# EAGLE design Schematic (EAGLE 9.4.0)
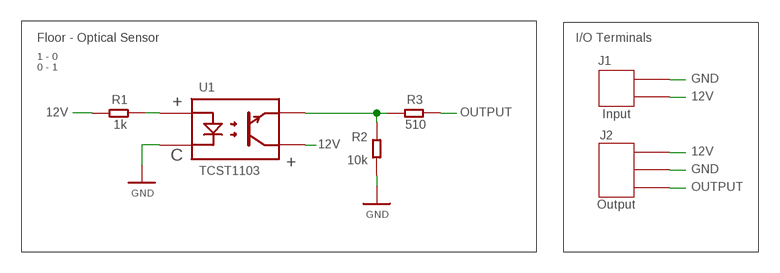
[diagram p0: schematic, sheet 1]

## Parts
J1  WF-2R  [WF-2R]
J2  WF-3R  [WF-3R]
R1  1k  SMD-RES-0603  [SMD-RES-0603]
R2  10k  SMD-RES-0603  [SMD-RES-0603]
R3  510  SMD-RES-0603  [SMD-RES-0603]
U1  TCST1103  [TCST1103]

## Nets
12V: J1.P$1 J2.P$3 R1.2 U1.OUTPUT_VCC
GND: J1.P$2 J2.P$2 R2.2 U1.INPUT_C(C)
N$1: R1.1 U1.INPUT_VCC
N$2: R2.1 R3.2 U1.OUTPUT
OUTPUT: J2.P$1 R3.1

## Notes on the sheet
- Floor - Optical Sensor | I/O Terminals
- 1 - 0
- 0 - 1
- Input
- Output

## Library data of the parts
J1 = Elevator:WF-2R: WF-2R - Socket x2 pins Step - 2.54
J2 = Elevator:WF-3R: WF-3R - Socket x3 pins Step - 2.54
R1-R3 = Network_Board Lib:SMD-RES-0603: SMD Resistor 0603 Size Reccomended for use. Vishay design source
U1 = Elevator:TCST1103: TCST1103 - Transmissive Optical Sensor with Phototransistor Output Vishay

## Board
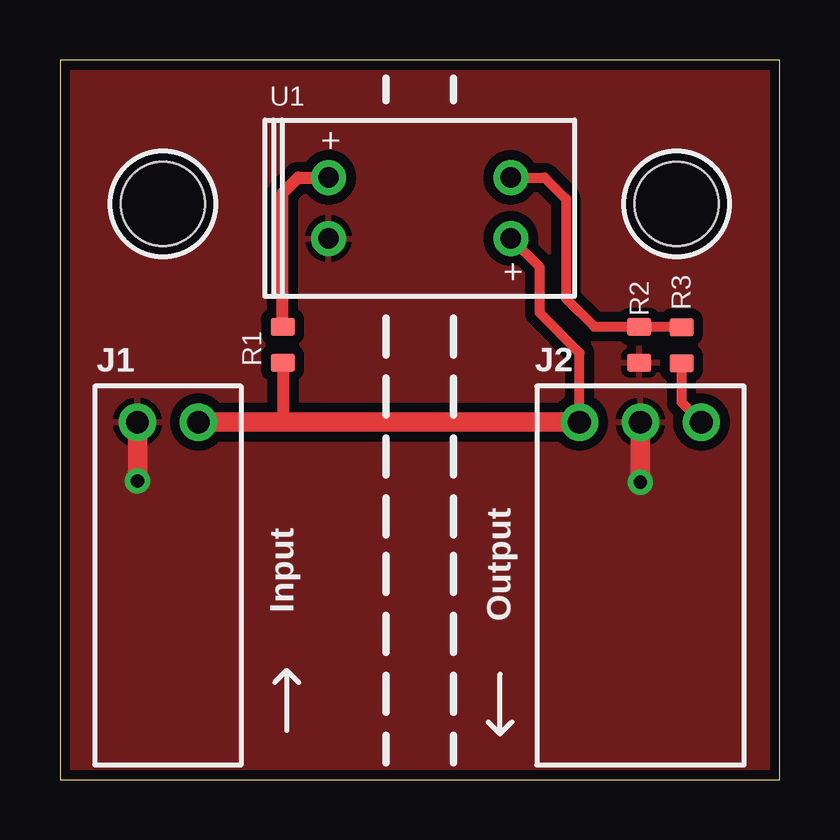
[diagram p1: board, top side]
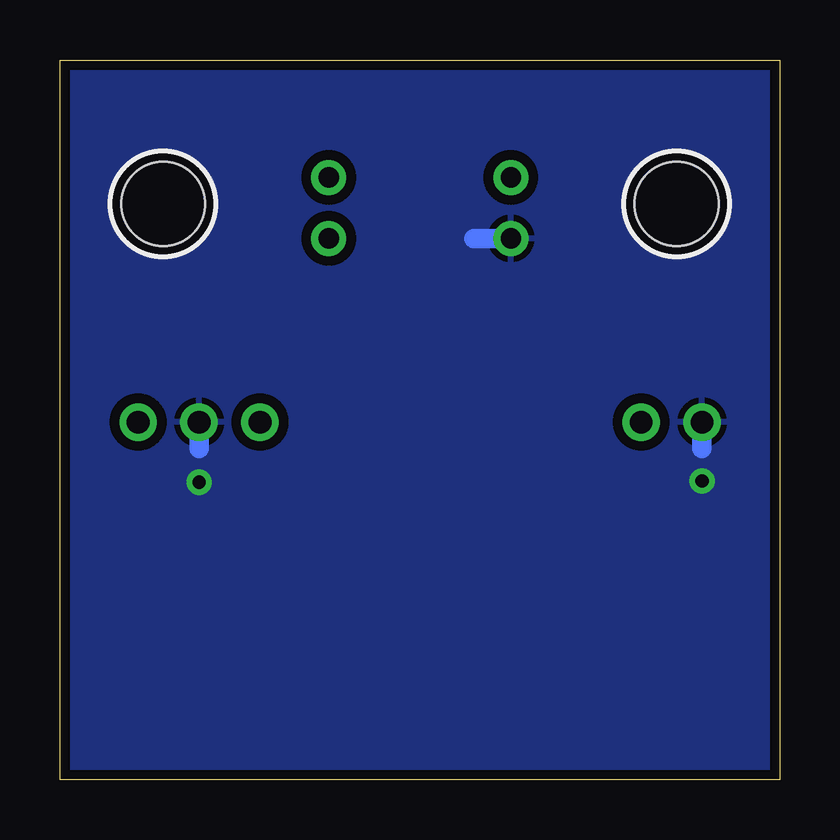
[diagram p2: board, bottom side, seen from below]

Size 30 x 30 mm. Coordinates in mm from the lower left corner, seen from the top.
Outline: 0,0 30,0 30,30 0,30 0,0
Copper layers (1*16): Top 0.035mm / dielectric 1.5mm / Bottom 0.035mm
Design rules "SparkFun PCB Checker": minimum track width 8mil, minimum drill 20mil, track to track 8mil, track to pad 8mil, pad to pad 8mil, via to via 8mil, smd to smd 8mil, copper to edge 8mil, drill to drill 8mil, minimum pad ring 12mil, minimum via ring 10mil, stop-mask expansion 4mil, vias tented up to drill 20mil, thermal gap 10mil
Holes 3.5 mm at 4.3,24 25.7,24

### Footprints (pad centres in the part's own frame; a part is rotated, then mirrored left to right if it is on the bottom)
WF-2R = drill 0.95: P$1 -1.27,0; P$2 1.27,0
WF-3R = drill 0.95: P$1 -2.54,0; P$2 0,0; P$3 2.54,0
SMD-RES-0603 = smd 0.75 x 1: 1 -0.76,0.04; 2 0.74,0.04
TCST1103 = drill 0.85 pad 1.422: INPUT_C 0,-2.54; INPUT_VCC 0,0; OUTPUT 7.6,0; OUTPUT_VCC 7.6,-2.54

### Placement (x,y rotation side)
J1  4.5,14.9 180 top
J2  24.2,14.9 180 top
R1  9.25,18.12 270 top
R2  24.11,18.12 270 top
R3  25.95,18.12 90 top
U1  11.2,25.1 0 top

### Tracks (layer width: path | path; a pad name or v marks a point on that pad's centre or on a via)
12V
  Top 0.406: U1.OUTPUT_VCC 20,21.36 20,19.45 21.66,17.79 J2.P$3
  Top 0.508: 10.49,14.94 10.45,14.9 | 18.8,14.95 18.75,14.9 | R1.2 9.3,17.36 9.3,14.9
  Top 0.813: J1.P$1 9.3,14.9 10.45,14.9 18.75,14.9 J2.P$3
GND  (via drill 0.55)
  Top 0.813: J1.P$2 v3.23,12.45 | J2.P$2 v24.2,12.4
  Bottom 0.813: J2.P$2 24.2,13.8 | J1.P$2 3.23,13.8 | U1.INPUT_C 12.75,22.56
  pour Top (isolate 0.406): 0,30 30,30 30,0 0,0
  pour Bottom (isolate 0.406): 0,30 30,30 30,0 0,0
N$1
  Top 0.508: R1.1 9.29,24.45 9.93,25.1 U1.INPUT_VCC
N$2
  Top 0.406: U1.OUTPUT 20.2,25.1 21.1,24.2 21.1,20.05 22.27,18.88 R2.1 25.89,18.88
  Top 0.508: 25.89,18.88 R3.2
OUTPUT
  Top 0.406: J2.P$1 25.91,15.73 R3.1

### Text on the board
tNames: Input | Output